# Altium schematic sheet N-CW7_PWR_TWB.SchDoc
size A3; SheetNumber: 3; SheetTotal: 3
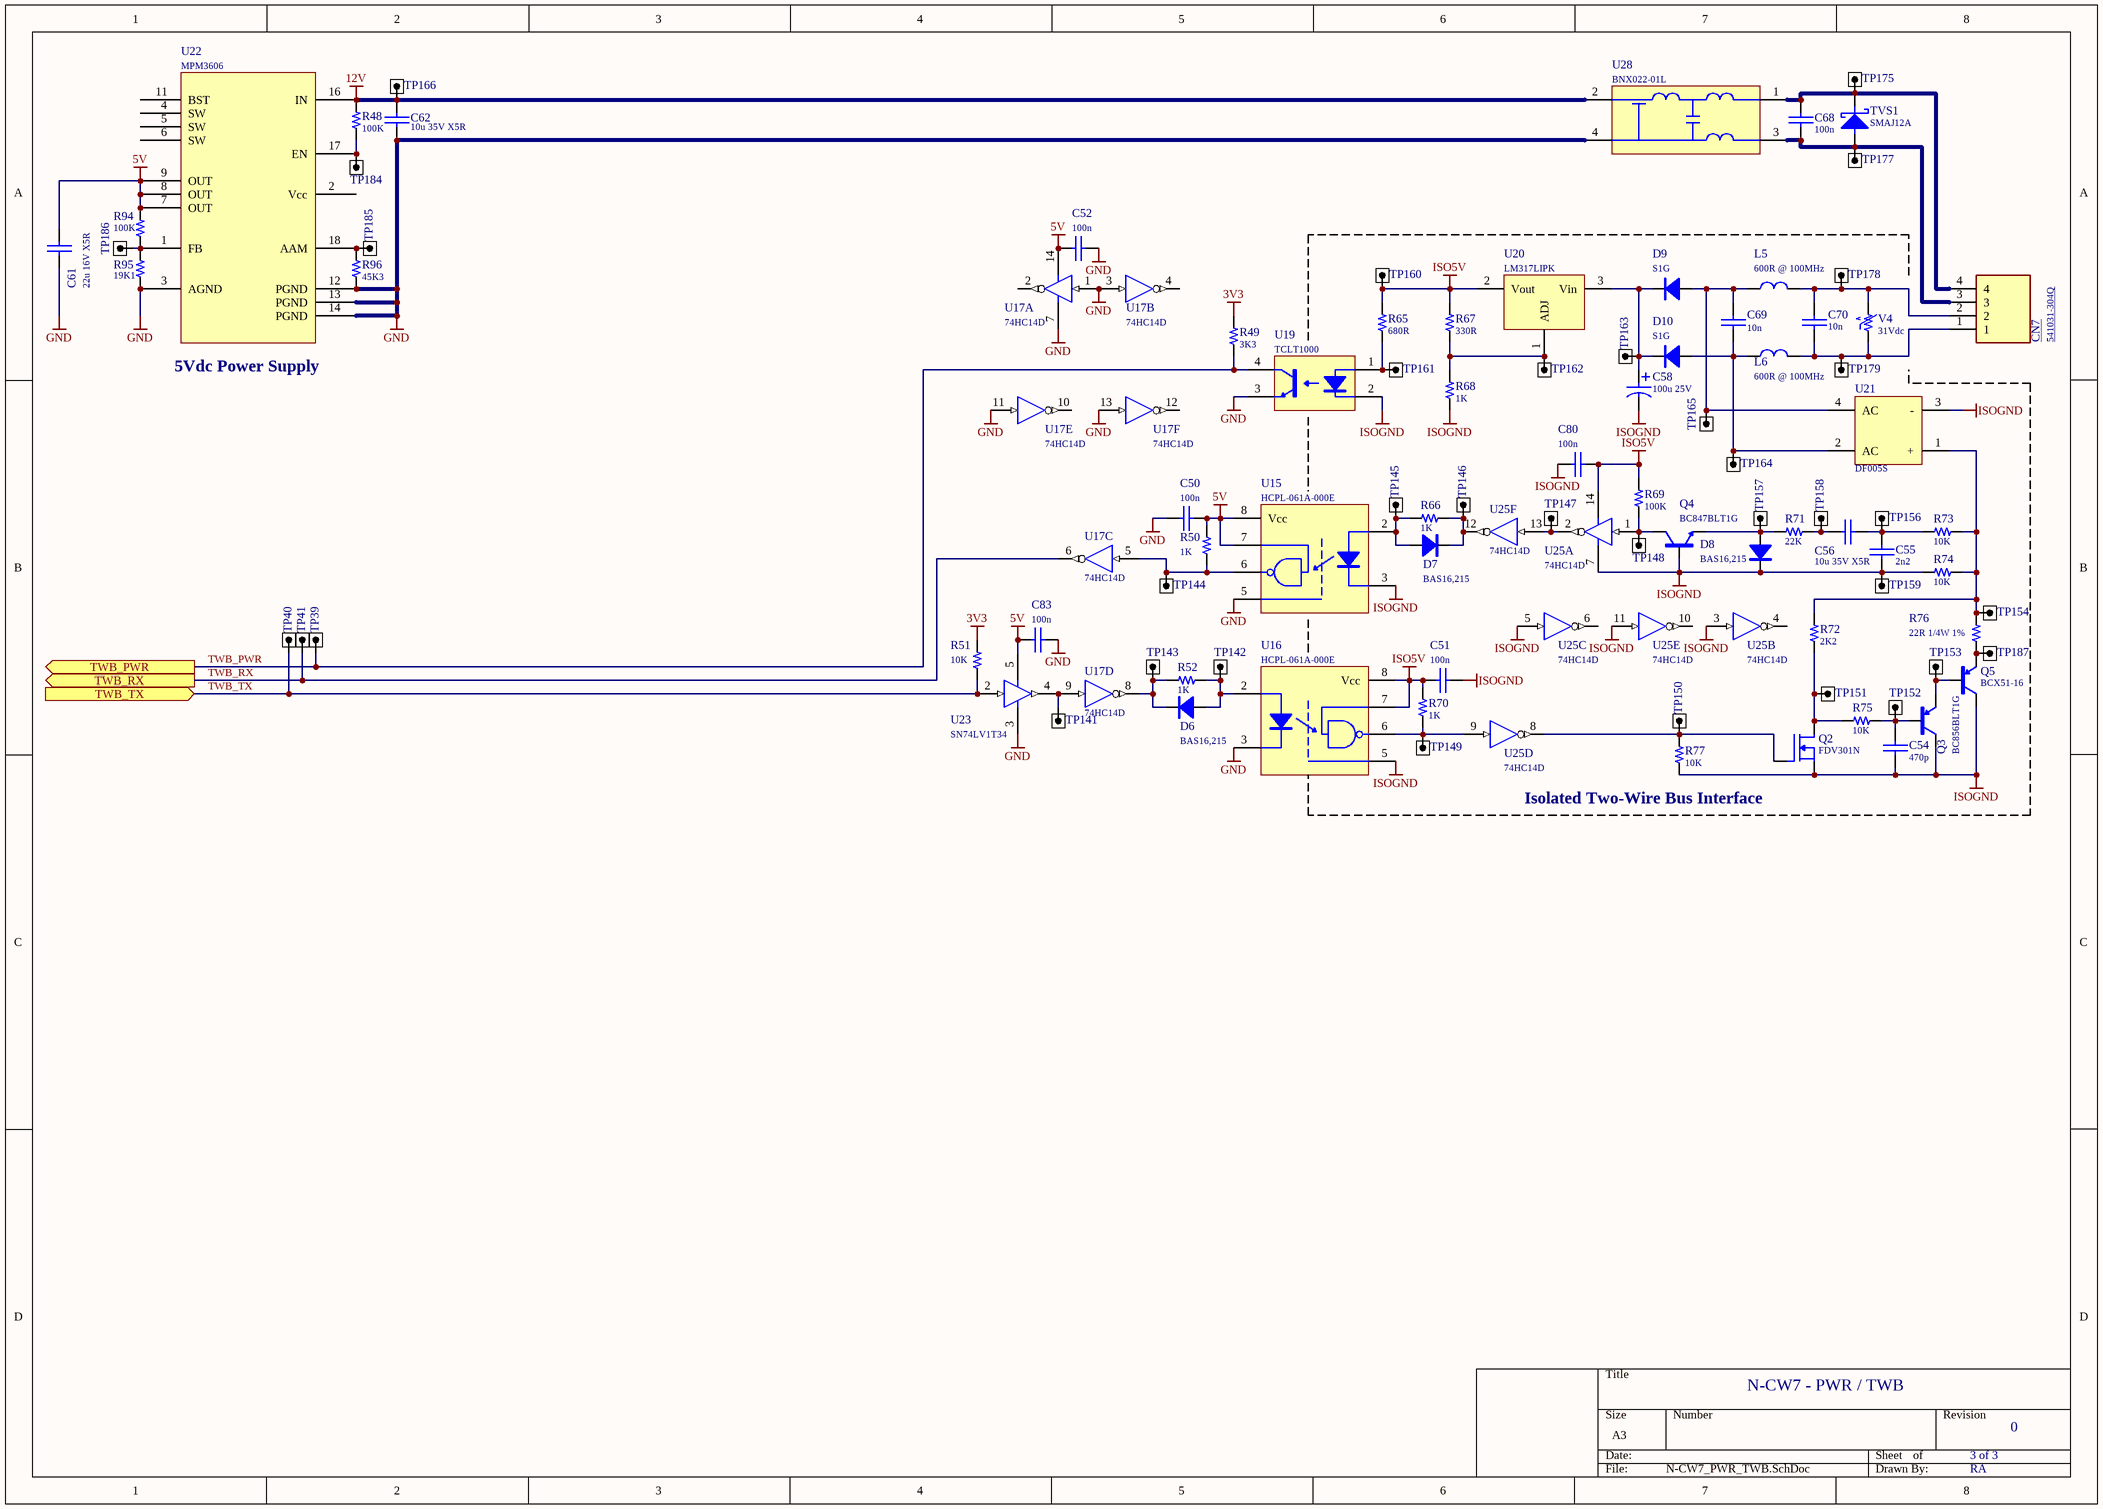
[diagram p0: N-CW7_PWR_TWB.SchDoc]

## Parts
C50  100n  [TDK_0603_T0.80:CAPC1608X08N]
C51  100n  [TDK_0603_T0.80:CAPC1608X08N]
C52  100n  [TDK_0603_T0.80:CAPC1608X08N]
C54  470p  [TDK_0603_T0.80:CAPC1608X08N]
C55  2n2  [TDK_0603_T0.80:CAPC1608X08N]
C56  10u 35V X5R  [KEMET_1210_T1.90:CAPC3225X19N]
C58  100u 25V  [KEMET_T494X/7343-43:CAPMP7343X43N]
C61  22u 16V X5R  [TDK_0805_T1.25:CAPC2013X12N]
C62  10u 35V X5R  [KEMET_1210_T1.90:CAPC3225X19N]
C68  100n  [TDK_0603_T0.80:CAPC1608X08N]
C69  10n  [TDK_0603_T0.80:CAPC1608X08N]
C70  10n  [TDK_0603_T0.80:CAPC1608X08N]
C80  100n  [TDK_0603_T0.80:CAPC1608X08N]
C83  100n  [TDK_0603_T0.80:CAPC1608X08N]
CN7  541031-304Q  [JWT_A2501WR2-4P:PS2.50MM]
D6  BAS16,215  [NEXPERIA_BAS16,215_SOT_23:SOT95P230X110-3N]
D7  BAS16,215  [NEXPERIA_BAS16,215_SOT_23:SOT95P230X110-3N]
D8  BAS16,215  [NEXPERIA_BAS16,215_SOT_23:SOT95P230X110-3N]
D9  S1G  [DIODESINC_S1G_SMA_D0214AC:DIOM4326X24N]
D10  S1G  [DIODESINC_S1G_SMA_D0214AC:DIOM4326X24N]
L5  600R @ 100MHz  [LAIRD_MI0805K601R-10:INDC2012X09N]
L6  600R @ 100MHz  [LAIRD_MI0805K601R-10:INDC2012X09N]
Q2  FDV301N  [ONSEMI_FDV301N_SOT23:SOT95P230X110-3N]
Q3  BC856BLT1G  [ONSEMI_BC856BLT1G_SOT23_SOT95P237X110-3N]
Q4  BC847BLT1G  [ONSEMI_BC847BLT1G_SOT23:SOT95P230X110-3N]
Q5  BCX51-16  [INFINEON_BCX51-16_SOT89:SOT89-150P400X150-3N]
R48  100K  [YAGEO_0603_T0.55:RESC1608X06N]
R49  3K3  [YAGEO_0603_T0.55:RESC1608X06N]
R50  1K  [YAGEO_0603_T0.55:RESC1608X06N]
R51  10K  [YAGEO_0603_T0.55:RESC1608X06N]
R52  1K  [YAGEO_0603_T0.55:RESC1608X06N]
R65  680R  [YAGEO_0603_T0.55:RESC1608X06N]
R66  1K  [YAGEO_0603_T0.55:RESC1608X06N]
R67  330R  [YAGEO_0603_T0.55:RESC1608X06N]
R68  1K  [YAGEO_0603_T0.55:RESC1608X06N]
R69  100K  [YAGEO_0603_T0.55:RESC1608X06N]
R70  1K  [YAGEO_0603_T0.55:RESC1608X06N]
R71  22K  [YAGEO_0603_T0.55:RESC1608X06N]
R72  2K2  [YAGEO_0603_T0.55:RESC1608X06N]
R73  10K  [YAGEO_0603_T0.55:RESC1608X06N]
R74  10K  [YAGEO_0603_T0.55:RESC1608X06N]
R75  10K  [YAGEO_0603_T0.55:RESC1608X06N]
R76  22R 1/4W 1%  [YAGEO_1206_T0.55:RESC3116X06N]
R77  10K  [YAGEO_0603_T0.55:RESC1608X06N]
R94  100K  [YAGEO_0603_T0.55:RESC1608X06N]
R95  19K1  [YAGEO_0603_T0.55:RESC1608X06N]
R96  45K3  [YAGEO_0603_T0.55:RESC1608X06N]
TP39  TESTPOINT_OCTAGONAL  [TESTPOINT_OCTAGONAL]  (value not drawn)
TP40  TESTPOINT_OCTAGONAL  [TESTPOINT_OCTAGONAL]  (value not drawn)
TP41  TESTPOINT_OCTAGONAL  [TESTPOINT_OCTAGONAL]  (value not drawn)
TP141  TESTPOINT_OCTAGONAL  [TESTPOINT_OCTAGONAL]  (value not drawn)
TP142  TESTPOINT_OCTAGONAL  [TESTPOINT_OCTAGONAL]  (value not drawn)
TP143  TESTPOINT_OCTAGONAL  [TESTPOINT_OCTAGONAL]  (value not drawn)
TP144  TESTPOINT_OCTAGONAL  [TESTPOINT_OCTAGONAL]  (value not drawn)
TP145  TESTPOINT_OCTAGONAL  [TESTPOINT_OCTAGONAL]  (value not drawn)
TP146  TESTPOINT_OCTAGONAL  [TESTPOINT_OCTAGONAL]  (value not drawn)
TP147  TESTPOINT_OCTAGONAL  [TESTPOINT_OCTAGONAL]  (value not drawn)
TP148  TESTPOINT_OCTAGONAL  [TESTPOINT_OCTAGONAL]  (value not drawn)
TP149  TESTPOINT_OCTAGONAL  [TESTPOINT_OCTAGONAL]  (value not drawn)
TP150  TESTPOINT_OCTAGONAL  [TESTPOINT_OCTAGONAL]  (value not drawn)
TP151  TESTPOINT_OCTAGONAL  [TESTPOINT_OCTAGONAL]  (value not drawn)
TP152  TESTPOINT_OCTAGONAL  [TESTPOINT_OCTAGONAL]  (value not drawn)
TP153  TESTPOINT_OCTAGONAL  [TESTPOINT_OCTAGONAL]  (value not drawn)
TP154  TESTPOINT_OCTAGONAL  [TESTPOINT_OCTAGONAL]  (value not drawn)
TP156  TESTPOINT_OCTAGONAL  [TESTPOINT_OCTAGONAL]  (value not drawn)
TP157  TESTPOINT_OCTAGONAL  [TESTPOINT_OCTAGONAL]  (value not drawn)
TP158  TESTPOINT_OCTAGONAL  [TESTPOINT_OCTAGONAL]  (value not drawn)
TP159  TESTPOINT_OCTAGONAL  [TESTPOINT_OCTAGONAL]  (value not drawn)
TP160  TESTPOINT_OCTAGONAL  [TESTPOINT_OCTAGONAL]  (value not drawn)
TP161  TESTPOINT_OCTAGONAL  [TESTPOINT_OCTAGONAL]  (value not drawn)
TP162  TESTPOINT_OCTAGONAL  [TESTPOINT_OCTAGONAL]  (value not drawn)
TP163  TESTPOINT_OCTAGONAL  [TESTPOINT_OCTAGONAL]  (value not drawn)
TP164  TESTPOINT_OCTAGONAL  [TESTPOINT_OCTAGONAL]  (value not drawn)
TP165  TESTPOINT_OCTAGONAL  [TESTPOINT_OCTAGONAL]  (value not drawn)
TP166  TESTPOINT_OCTAGONAL  [TESTPOINT_OCTAGONAL]  (value not drawn)
TP175  TESTPOINT_OCTAGONAL  [TESTPOINT_OCTAGONAL]  (value not drawn)
TP177  TESTPOINT_OCTAGONAL  [TESTPOINT_OCTAGONAL]  (value not drawn)
TP178  TESTPOINT_OCTAGONAL  [TESTPOINT_OCTAGONAL]  (value not drawn)
TP179  TESTPOINT_OCTAGONAL  [TESTPOINT_OCTAGONAL]  (value not drawn)
TP184  TESTPOINT_OCTAGONAL  [TESTPOINT_OCTAGONAL]  (value not drawn)
TP185  TESTPOINT_OCTAGONAL  [TESTPOINT_OCTAGONAL]  (value not drawn)
TP186  TESTPOINT_OCTAGONAL  [TESTPOINT_OCTAGONAL]  (value not drawn)
TP187  TESTPOINT_OCTAGONAL  [TESTPOINT_OCTAGONAL]  (value not drawn)
TVS1  SMAJ12A  [LITTELFUSE_SMAJ12A_D0214AC:DIOM4326X23N]
U15  HCPL-061A-000E  [BROADCOM_HCPL-061A-000E:SOIC127P600X338-8N]
U16  HCPL-061A-000E  [BROADCOM_HCPL-061A-000E:SOIC127P600X338-8N]
U17  74HC14D  [NEXPERIA_74HC14D_SO14:SOIC127P600X175-14N]  (parts A,B,C,D,E,F of 6)
U19  TCLT1000  [VISHAY_TCLT1000_SOP4L:SOP254P1020X230-4N]
U20  LM317LIPK  [TI_LM317LIPK_SOT89:SOT89-150P350X160-3N]
U21  DF005S  [DIODESINC_DF005S:SOP520P1040X265-4N]
U22  MPM3606  [MPS_MPM3606GQV-P]
U23  SN74LV1T34  [TI_SN74LV1T34_SOT23_5:SOT95P280X145-5N]
U25  74HC14D  [NEXPERIA_74HC14D_SO14:SOIC127P600X175-14N]  (parts A,B,C,D,E,F of 6)
U28  BNX022-01L  [MURATA_BNX022-01L]
V4  31Vdc  [TDK_B72520_1206:INDC3216X17N]

## Ports
TWB_PWR (out), TWB_RX (out), TWB_TX (in)

## Nets
3V3: R49.2 R51.1
5V: C50.2 C52.1 C61.2 C83.1 R50.1 R94.1 U15.7 U15.8(Vcc) U17.14(Vcc) U22.7(OUT) U22.8(OUT) U22.9(OUT) U23.5(Vcc)
12V: C62.2 R48.1 TP166.1 U22.16(IN) U28.2(CB)
GND: C50.1 C52.2 C61.1 C62.1 C83.2 R95.2 R96.1 U15.5 U16.3 U17.1(A1) U17.3(A2) U17.7(GND) U17.11(A5) U17.13(A6) U19.3 U22.3(AGND) U22.12(PGND) U22.13(PGND) U22.14(PGND) U23.3(GND) U28.4(CG)
ISO5V: C51.1 C80.2 R65.2 R67.1 R69.1 R70.1 TP160.1 U16.7 U16.8(Vcc) U20.2(Vout) U25.14(Vcc)
ISOGND: C51.2 C54.1 C55.1 C58.2 C80.1 D8.3(K) Q2.2(S) Q3.3(C) Q4.1(B) Q5.2(C) R68.2 R74.1 R77.1 TP159.1 U15.3 U16.5 U19.2 U21.3(-) U25.3(A2) U25.5(A3) U25.7(GND) U25.11(A5)
TWB_PWR: R49.1 TP39.1 U19.4 ; port TWB_PWR
TWB_RX: TP41.1 U17.6(Y3) ; port TWB_RX
TWB_TX: R51.2 TP40.1 U23.2(A) ; port TWB_TX
NetC54_2: C54.2 Q3.1(B) R75.2 TP152.1
NetC55_2: C55.2 C56.1 R73.1 TP156.1
NetC56_2: C56.2 R71.2 TP158.1
NetC58_1: C58.1 D9.1(K) D10.1(K) TP163.1 U20.3(Vin)
NetC68_1: C68.1 CN7.3 TP177.1 TVS1.2(A) U28.3(PSG)
NetC68_2: C68.2 CN7.4 TP175.1 TVS1.1(K) U28.1(B)
NetC69_1: C69.1 D10.2(A) L6.1 TP164.1 U21.2(AC)
NetC69_2: C69.2 D9.2(A) L5.1 TP165.1 U21.4(AC)
NetC70_1: C70.1 CN7.1 L6.2 TP179.1 V4.2
NetC70_2: C70.2 CN7.2 L5.2 TP178.1 V4.1
NetD6_1: D6.1(A) R52.2 TP142.1 U16.2
NetD6_3: D6.3(K) R52.1 TP143.1 U17.8(Y4)
NetD7_1: D7.1(A) R66.2 TP145.1 U15.2
NetD7_3: D7.3(K) R66.1 TP146.1 U25.12(Y6)
NetD8_1: D8.1(A) Q4.2(E) R71.1 TP157.1
NetQ2_1: Q2.1(G) R77.2 TP150.1 U25.8(Y4)
NetQ2_3: Q2.3(D) R72.1 R75.1 TP151.1
NetQ3_2: Q3.2(E) Q5.1(B) TP153.1
NetQ4_3: Q4.3(C) R69.2 TP148.1 U25.1(A1)
NetQ5_3: Q5.3(E) R76.1 TP187.1
NetR48_2: R48.2 TP184.1 U22.17(EN)
NetR50_2: R50.2 TP144.1 U15.6 U17.5(A3)
NetR65_1: R65.1 TP161.1 U19.1
NetR67_2: R67.2 R68.1 TP162.1 U20.1(ADJ)
NetR70_2: R70.2 TP149.1 U16.6 U25.9(A4)
NetR72_2: R72.2 R73.2 R74.2 R76.2 TP154.1 U21.1(+)
NetR94_2: R94.2 R95.1 TP186.1 U22.1(FB)
NetR96_2: R96.2 TP185.1 U22.18(AAM)
NetTP141_1: TP141.1 U17.9(A4) U23.4(Y)
NetTP147_1: TP147.1 U25.2(Y1) U25.13(A6)

Not connected (* = marked no-connect by the designer): U17 2(Y1) 4(Y2) 10(Y5) 12(Y6); U22 2(Vcc) 4(SW) 5(SW) 6(SW) 11(BST); U25 4(Y2) 6(Y3) 10(Y5)

## Notes on the sheet
- (near U22) 5Vdc Power Supply
- Isolated Two-Wire Bus Interface
- N-CW7 - PWR / TWB
- 3 of 3
- 0
- RA

## Library data of the parts
C50-C52 C68 C80 C83 = TDK_0603_T0.80: CAP CER 0.1UF 50V X7R 0603; Manufacturer: TDK; Manufacturer Part Number: C1608X7R1H104K080AA; ComponentLink1Description: Datasheet - TDK; ComponentLink1URL: https://product.tdk.com/system/files/dam/doc/product/capacitor/ceramic/mlcc/catalog/mlcc_commercial_general_en.pdf; Supplier 1: Digi-Key; Supplier Part Number 1: 445-1314-1-ND; Supplier 2: Mouser; Supplier Part Number 2: 810-C1608X7R1H104K
C54 = TDK_0603_T0.80: CAP CER 470PF 50V C0G 0603; Manufacturer: TDK; Manufacturer Part Number: C1608C0G1H471J080AA; ComponentLink1Description: Datasheet - TDK; ComponentLink1URL: https://product.tdk.com/system/files/dam/doc/product/capacitor/ceramic/mlcc/catalog/mlcc_commercial_general_en.pdf; Supplier 1: Digi-Key; Supplier Part Number 1: 445-1289-1-ND; Supplier 2: Mouser; Supplier Part Number 2: 810-C1608C0G1H471J
C55 = TDK_0603_T0.80: CAP CER 2200PF 50V X7R 0603; Manufacturer: TDK; Manufacturer Part Number: C1608X7R1H222K080AE; ComponentLink1Description: Datasheet - TDK; ComponentLink1URL: https://product.tdk.com/system/files/dam/doc/product/capacitor/ceramic/mlcc/catalog/mlcc_commercial_general_en.pdf; Supplier 1: Digikey; Supplier Part Number 1: 445-173664-1-ND; Supplier 2: Mouser; Supplier Part Number 2: 810-C1608X7R1H222KAE
C56 C62 = KEMET_1210_T1.90: CAP CER 10UF 35V X5R 1210; Manufacturer: KEMET; Manufacturer Part Number: C1210C106K6PACTU; ComponentLink1Description: Datasheet - KEMET; ComponentLink1URL: https://content.kemet.com/datasheets/KEM_C1006_X5R_SMD.pdf; Supplier 1: Digi-Key; Supplier Part Number 1: 399-12070-1-ND; Supplier 2: Mouser; Supplier Part Number 2: 80-C1210C106K6P
C58 = KEMET_T494X/EIA7343-43: CAP TANT 100UF 20% 25V 2917; Manufacturer: KEMET; Manufacturer Part Number: T494X107M025AT; ComponentLink1Description: Datasheet - KEMET; ComponentLink1URL: https://content.kemet.com/datasheets/KEM_T2008_T494.pdf; Supplier 1: Mouser; Supplier Part Number 1: 80-T494X107M025; Supplier 2: Digikey; Supplier Part Number 2: 399-8485-1-ND
C61 = TDK_0805_T1.25: CAP CER 22UF 16V X5R 0805; Manufacturer: TDK; Manufacturer Part Number: C2012X5R1C226M085AC; ComponentLink1Description: Datasheet - TDK; ComponentLink1URL: https://product.tdk.com/system/files/dam/doc/product/capacitor/ceramic/mlcc/catalog/mlcc_commercial_general_en.pdf; Supplier 1: Digikey; Supplier Part Number 1: 445-14374-1-ND; Supplier 2: Mouser; Supplier Part Number 2: 810-C2012X5R1C226MAC
C69 C70 = TDK_0603_T0.80: CAP CER 10000PF 50V X7R 0603; Manufacturer: TDK; Manufacturer Part Number: C1608X7R1H103K080AA; ComponentLink1Description: Datasheet - TDK; ComponentLink1URL: https://product.tdk.com/system/files/dam/doc/product/capacitor/ceramic/mlcc/catalog/mlcc_commercial_general_en.pdf; Supplier 1: Digi-Key; Supplier Part Number 1: 445-1311-1-ND; Supplier 2: Mouser; Supplier Part Number 2: 810-C1608X7R1H103K
CN7 = JWT_A2501WR2-4P: A2501WR2-4P (JWT) 2.50mm Pitch (R-DIP); ComponentLink1Description: Datasheet - JWT; ComponentLink1URL: http://www.jwt.com.tw/pro_pdf/A2501.pdf
D6-D8 = NEXPERIA_BAS16,215_SOT23: DIODE GP 100V 215MA SOT23; Manufacturer: Nexperia; Manufacturer Part Number: BAS16,215; Supplier 1: Digi-Key; Supplier Part Number 1: 1727-2887-6-ND; Supplier 2: Mouser; Supplier Part Number 2: 771-BAS16-T/R; ComponentLink1Description: Datasheet - NEXPERIA; ComponentLink1URL: https://assets.nexperia.com/documents/data-sheet/BAS16_SER.pdf?src-supplier=Digi-Key
D9 D10 = DIODESINC_S1G_SMA_D0214AC: DIODE GEN PURP 400V 1A SMA; Manufacturer: Diodes; Manufacturer Part Number: S1G-13-F; Supplier 1: Digi-Key; Supplier Part Number 1: S1G-FDICT-ND; Supplier 2: Mouser; Supplier Part Number 2: 621-S1G-F; ComponentLink1Description: Datasheet - DIODESINC; ComponentLink1URL: https://datasheet.ciiva.com/4453/ds16003-83672-4453663.pdf?src-supplier=Mouser
L5 L6 = LAIRD_MI0805K601R-10: FERRITE BEAD 600 OHM 0805 1LN; Manufacturer: Laird; Manufacturer Part Number: MI0805K601R-10; Supplier 1: Digi-Key; Supplier Part Number 1: 240-2390-1-ND; Supplier 2: Mouser; Supplier Part Number 2: 875-MI0805K601R-10; ComponentLink1Description: Datasheet - LAIRD; ComponentLink1URL: https://datasheet.ciiva.com/1013/mi0805k601r-10-b-1013299.pdf?src-supplier=Digi-Key
Q2 = ONSEMI_FDV301N_SOT23: MOSFET N-CH 25V 220MA SOT23; Manufacturer: ON Semiconductor / Fairchild; Manufacturer Part Number: FDV301N; Supplier 1: Digi-Key; Supplier Part Number 1: FDV301NCT-ND; Supplier 2: Mouser; Supplier Part Number 2: 512-FDV301N; ComponentLink1Description: Datasheet - ONSEMI; ComponentLink1URL: https://datasheet.ciiva.com/931/fdv301n-931766.pdf?src-supplier=Digi-Key
Q3 = ONSEMI_BC856BLT1G_SOT23: TRANS PNP 65V 100MA SOT23-3; Manufacturer: ON Semiconductor; Manufacturer Part Number: BC856BLT1G; Supplier 1: Digi-Key; Supplier Part Number 1: BC856BLT1GOSCT-ND; Supplier 2: Mouser; Supplier Part Number 2: 863-BC856BLT1G; ComponentLink1Description: Datasheet - ONSEMI; ComponentLink1URL: https://datasheet.ciiva.com/976/bc856alt1-d-976400.pdf?src-supplier=Digi-Key
Q4 = ONSEMI_BC847BLT1G_SOT23: TRANS NPN 45V 100MA SOT23-3; Manufacturer: ON Semiconductor; Manufacturer Part Number: BC847BLT1G; Supplier 1: Digi-Key; Supplier Part Number 1: BC847BLT1GOSCT-ND; Supplier 2: Mouser; Supplier Part Number 2: 863-BC847BLT1G; ComponentLink1Description: Datasheet - ONSEMI; ComponentLink1URL: https://datasheet.ciiva.com/976/bc846alt1-d-976378.pdf?src-supplier=Digi-Key
Q5 = INFINEON_BCX51-16_SOT89: Bipolar (BJT) Transistor PNP 45 V 1 A 125MHz 2 W Surface Mount PG-SOT89; Manufacturer: Infineon; Manufacturer Part Number: BCX51-16; Supplier 1: Digi-Key; Supplier Part Number 1: BCX5116H6327XTSA1-ND; Supplier 2: Mouser; Supplier Part Number 2: 726-BCX5116H6327XTSA; ComponentLink1Description: Datasheet - INFINEON; ComponentLink1URL: https://datasheet.ciiva.com/29323/153187-da-01-en-transistor-af-bcx51-16-sot89-inf-29323667.pdf?src-supplier=Conrad
R48 R69 R94 = YAGEO_0603_T0.55: RES 100K OHM 1% 1/10W 0603; Manufacturer: Yageo; Manufacturer Part Number: RC0603FR-07100KL; ComponentLink1Description: Datasheet - YAGEO; ComponentLink1URL: https://www.yageo.com/upload/media/product/productsearch/datasheet/rchip/PYu-RC_Group_51_RoHS_L_11.pdf; Supplier 1: Digi-Key; Supplier Part Number 1: 311-100KHRCT-ND; Supplier 2: Mouser; Supplier Part Number 2: 603-RC0603FR-07100KL
R49 = YAGEO_0603_T0.55: RC0603FR-07XXXL; Manufacturer: Yageo; Manufacturer Part Number: RC0603FR-073K3L; ComponentLink1Description: Datasheet - YAGEO; ComponentLink1URL: https://www.yageo.com/upload/media/product/productsearch/datasheet/rchip/PYu-RC_Group_51_RoHS_L_11.pdf; Supplier 1: Digikey; Supplier Part Number 1: 311-3.30KHRCT-ND; Supplier 2: Mouser; Supplier Part Number 2: 603-RC0603FR-073K3L
R50 R52 R66 R68 R70 = YAGEO_0603_T0.55: RES 1K OHM 1% 1/10W 0603; Manufacturer: Yageo; Manufacturer Part Number: RC0603FR-071KL; ComponentLink1Description: Datasheet - YAGEO; ComponentLink1URL: https://www.yageo.com/upload/media/product/productsearch/datasheet/rchip/PYu-RC_Group_51_RoHS_L_11.pdf; Supplier 1: Digi-Key; Supplier Part Number 1: 311-1.00KHRCT-ND; Supplier 2: Mouser; Supplier Part Number 2: 603-RC0603FR-071KL
R51 R73-R75 R77 = YAGEO_0603_T0.55: RES 10K OHM 1% 1/10W 0603; Manufacturer: Yageo; Manufacturer Part Number: RC0603FR-0710KL; ComponentLink1Description: Datasheet - YAGEO; ComponentLink1URL: https://www.yageo.com/upload/media/product/productsearch/datasheet/rchip/PYu-RC_Group_51_RoHS_L_11.pdf; Supplier 1: Digi-Key; Supplier Part Number 1: 311-10.0KHRCT-ND; Supplier 2: Mouser; Supplier Part Number 2: 603-RC0603FR-0710KL
R65 = YAGEO_0603_T0.55: RES 680 OHM 1% 1/10W 0603; Manufacturer: Yageo; Manufacturer Part Number: RC0603FR-07680RL; ComponentLink1Description: Datasheet - YAGEO; ComponentLink1URL: https://www.yageo.com/upload/media/product/productsearch/datasheet/rchip/PYu-RC_Group_51_RoHS_L_11.pdf; Supplier 1: Digikey; Supplier Part Number 1: 311-680HRCT-ND; Supplier 2: Mouser; Supplier Part Number 2: 603-RC0603FR-07680RL
R67 = YAGEO_0603_T0.55: RES 330 OHM 1% 1/10W 0603; Manufacturer: Yageo; Manufacturer Part Number: RC0603FR-07330RL; ComponentLink1Description: Datasheet - YAGEO; ComponentLink1URL: https://www.yageo.com/upload/media/product/productsearch/datasheet/rchip/PYu-RC_Group_51_RoHS_L_11.pdf; Supplier 1: Digi-Key; Supplier Part Number 1: 311-330HRCT-ND; Supplier 2: Mouser; Supplier Part Number 2: 603-RC0603FR-07330RL
R71 = YAGEO_0603_T0.55: RES 22K OHM 1% 1/10W 0603; Manufacturer: Yageo; Manufacturer Part Number: RC0603FR-0722KL; ComponentLink1Description: Datasheet - YAGEO; ComponentLink1URL: https://www.yageo.com/upload/media/product/productsearch/datasheet/rchip/PYu-RC_Group_51_RoHS_L_11.pdf; Supplier 1: Digi-Key; Supplier Part Number 1: 311-22.0KHRCT-ND; Supplier 2: Mouser; Supplier Part Number 2: 603-RC0603FR-0722KL
R72 = YAGEO_0603_T0.55: RES 2.2K OHM 1% 1/10W 0603; Manufacturer: Yageo; Manufacturer Part Number: RC0603FR-072K2L; ComponentLink1Description: Datasheet - YAGEO; ComponentLink1URL: https://www.yageo.com/upload/media/product/productsearch/datasheet/rchip/PYu-RC_Group_51_RoHS_L_11.pdf; Supplier 1: Digi-Key; Supplier Part Number 1: 311-2.20KHRCT-ND; Supplier 2: Mouser; Supplier Part Number 2: 603-RC0603FR-072K2L
R76 = YAGEO_1206_T0.55: RES 22 OHM 1% 1/4W 1206; Manufacturer: Yageo; Manufacturer Part Number: RC1206FR-0722RL; ComponentLink1Description: Datasheet - YAGEO; ComponentLink1URL: https://www.yageo.com/upload/media/product/products/datasheet/rchip/PYu-RC_Group_51_RoHS_L_12.pdf; Supplier 1: Digikey; Supplier Part Number 1: 311-22.0FRCT-ND; Supplier 2: Mouser; Supplier Part Number 2: 603-RC1206FR-0722RL
R95 = YAGEO_0603_T0.55: RES 19.1K OHM 1% 1/10W 0603; Manufacturer: Yageo; Manufacturer Part Number: RC0603FR-0719K1L; ComponentLink1Description: Datasheet - YAGEO; ComponentLink1URL: https://www.yageo.com/upload/media/product/productsearch/datasheet/rchip/PYu-RC_Group_51_RoHS_L_11.pdf; Supplier 1: Digikey; Supplier Part Number 1: 311-19.1KHRCT-ND; Supplier 2: Mouser; Supplier Part Number 2: 603-RC0603FR-0719K1L
R96 = YAGEO_0603_T0.55: RES 45.3K OHM 1% 1/10W 0603; Manufacturer: Yageo; Manufacturer Part Number: RC0603FR-0745K3L; ComponentLink1Description: Datasheet - YAGEO; ComponentLink1URL: https://www.yageo.com/upload/media/product/productsearch/datasheet/rchip/PYu-RC_Group_51_RoHS_L_11.pdf; Supplier 1: Digikey; Supplier Part Number 1: 311-45.3KHRCT-ND; Supplier 2: Mouser; Supplier Part Number 2: 603-RC0603FR-0745K3L
TVS1 = LITTELFUSE_SMAJ12A_D0214AC: TVS DIODE 12VWM 19.9VC DO214AC; Manufacturer: Littelfuse; Manufacturer Part Number: SMAJ12A; Supplier 1: Mouser; Supplier Part Number 1: 576-SMAJ12A; Supplier 2: Digi-Key; Supplier Part Number 2: SMAJ12ALFCT-ND; ComponentLink1Description: Datasheet - LITTELFUSE; ComponentLink1URL: https://www.littelfuse.com/~/media/electronics/datasheets/tvs_diodes/littelfuse_tvs_diode_smaj_datasheet.pdf.pdf
U15 U16 = BROADCOM_HCPL-061A-000E: OPTOISO 3.75KV OPN COLL 8SO TALL; Manufacturer: Broadcom Avago; Manufacturer Part Number: HCPL-061A-000E; Supplier 1: Digikey; Supplier Part Number 1: 516-1635-5-ND; Supplier 2: Mouser; Supplier Part Number 2: 630-HCPL-061A-000E; ComponentLink1Description: Datasheet - BROADCOM; ComponentLink1URL: https://docs.broadcom.com/doc/AV02-0391EN
U17 U25 = NEXPERIA_74HC14D_SO14: IC HEX INVERTER SCHM TRIG 14SOIC; Manufacturer Part Number: 74HC14D,653; Manufacturer: Nexperia; Supplier 1: Mouser; Supplier Part Number 1: 771-74HC14D-T; Supplier 2: Digi-Key; Supplier Part Number 2: 1727-2783-6-ND; ComponentLink1Description: Datasheet - Nexperia; ComponentLink1URL: https://assets.nexperia.com/documents/data-sheet/74HC_HCT14.pdf?src-supplier=Digi-Key
U19 = VISHAY_TCLT1000_SOP4L: OPTOISOLATOR 5KV 1CH TRANS 4-SOP; Manufacturer: Vishay; Manufacturer Part Number: TCLT1000; Supplier 1: Mouser; Supplier Part Number 1: 782-TCLT1000; Supplier 2: Digikey; Supplier Part Number 2: TCLT1000CT-ND; ComponentLink1Description: Datasheet - VISHAY; ComponentLink1URL: https://datasheet.ciiva.com/2085/tclt1000-2085920.pdf?src-supplier=Digikey
U20 = TI_LM317LIPK_SOT89: IC REG LIN POS ADJ 100MA SOT89-3; Manufacturer: Texas Instruments; Manufacturer Part Number: LM317LIPK; Supplier 1: Mouser; Supplier Part Number 1: 595-LM317LIPK; Supplier 2: Digikey; Supplier Part Number 2: 296-21742-1-ND; ComponentLink1Description: Datasheet - TI; ComponentLink1URL: https://datasheet.ciiva.com/2042/lm317l-2042778.pdf?src-supplier=Digikey
U21 = DIODESINC_DF005S: BRIDGE RECT 1PHASE 50V 1A DFS; Manufacturer: Diodes; Manufacturer Part Number: DF005S; Supplier 1: Digi-Key; Supplier Part Number 1: DF005SDI-ND; Supplier 2: Mouser; Supplier Part Number 2: 621-DF005S; ComponentLink1Description: Datasheet - DIODESINC; ComponentLink1URL: https://www.diodes.com/assets/Datasheets/ds17001.pdf
U22 = MPS_MPM3606GQV-P: DC DC CONVERTER 0.8-5.5V; Manufacturer: Monolithic Power Systems; Manufacturer Part Number: MPM3606GQV-P; Supplier 1: Digikey; Supplier Part Number 1: 1589-1248-1-ND; Supplier 2: Mouser; Supplier Part Number 2: 946-MPM3606GQV-P; ComponentLink1Description: Datasheet - MPS; ComponentLink1URL: https://www.monolithicpower.com/en/documentview/productdocument/index/version/2/document_type/Datasheet/lang/en/sku/MPM3606GQV/document_id/2094
U23 = TI_SN74LV1T34_SOT23_5: IC BUF NON-INVERT 5.5V SOT23-5; Manufacturer: Texas Instruments; Manufacturer Part Number: SN74LV1T34DBVR; Supplier 1: Digi-Key; Supplier Part Number 1: 296-37176-6-ND; Supplier 2: Mouser; Supplier Part Number 2: 595-SN74LV1T34DBVR; ComponentLink1Description: Datasheet - TI; ComponentLink1URL: https://datasheet.ciiva.com/29634/sn74lv1t34-29634758.pdf?src-supplier=Digi-Key
U28 = MURATA_BNX022-01L: FILTER LC 1UF SMD; Manufacturer: Murata; Manufacturer Part Number: BNX022-01L; Supplier 1: Mouser; Supplier Part Number 1: 81-BNX022-01L; Supplier 2: Digikey; Supplier Part Number 2: 490-5052-1-ND; ComponentLink1Description: Datasheet - MURATA; ComponentLink1URL: https://datasheet.ciiva.com/6211/bnx02x-series-6211239.pdf?src-supplier=Digikey
V4 = TDK_B72520_1206: VARISTOR 39V 200A 1206; Manufacturer: TDK EPCOS; Manufacturer Part Number: B72520T0250K062; ComponentLink1Description: Datasheet - TDK; ComponentLink1URL: https://datasheet.ciiva.com/366/ml-standard-ct-cn-366985.pdf?src-supplier=Digi-Key; Supplier 1: Digikey; Supplier Part Number 1: 495-4401-1-ND; Supplier 2: Mouser; Supplier Part Number 2: 871-B72520T250K62